# Altium schematic sheet 1_P1.schdoc
size 307 x 218 mm; Symbol: Drawing-Symbol_A4; Device: Drawing-Symbol_A4; @Project Name: orpheus552; @Page Count: 1; @Update Date: 2025-07-31; @Create Date: 2025-08-01; @Schematic Name: Schematic1; @Page No: 1; @Page Name: P1; Company: EasyEDA.com; Version: V1.0; Page Size: A4; @Create Time: 01:28:48; @Update Time: 18:28:48; Width: 1170; Height: 825; Region Start: 1; X Region Count: 6; Y Region Count: 4; Blade Width: 10; Title Block Position: 3; @Board Name: Board1
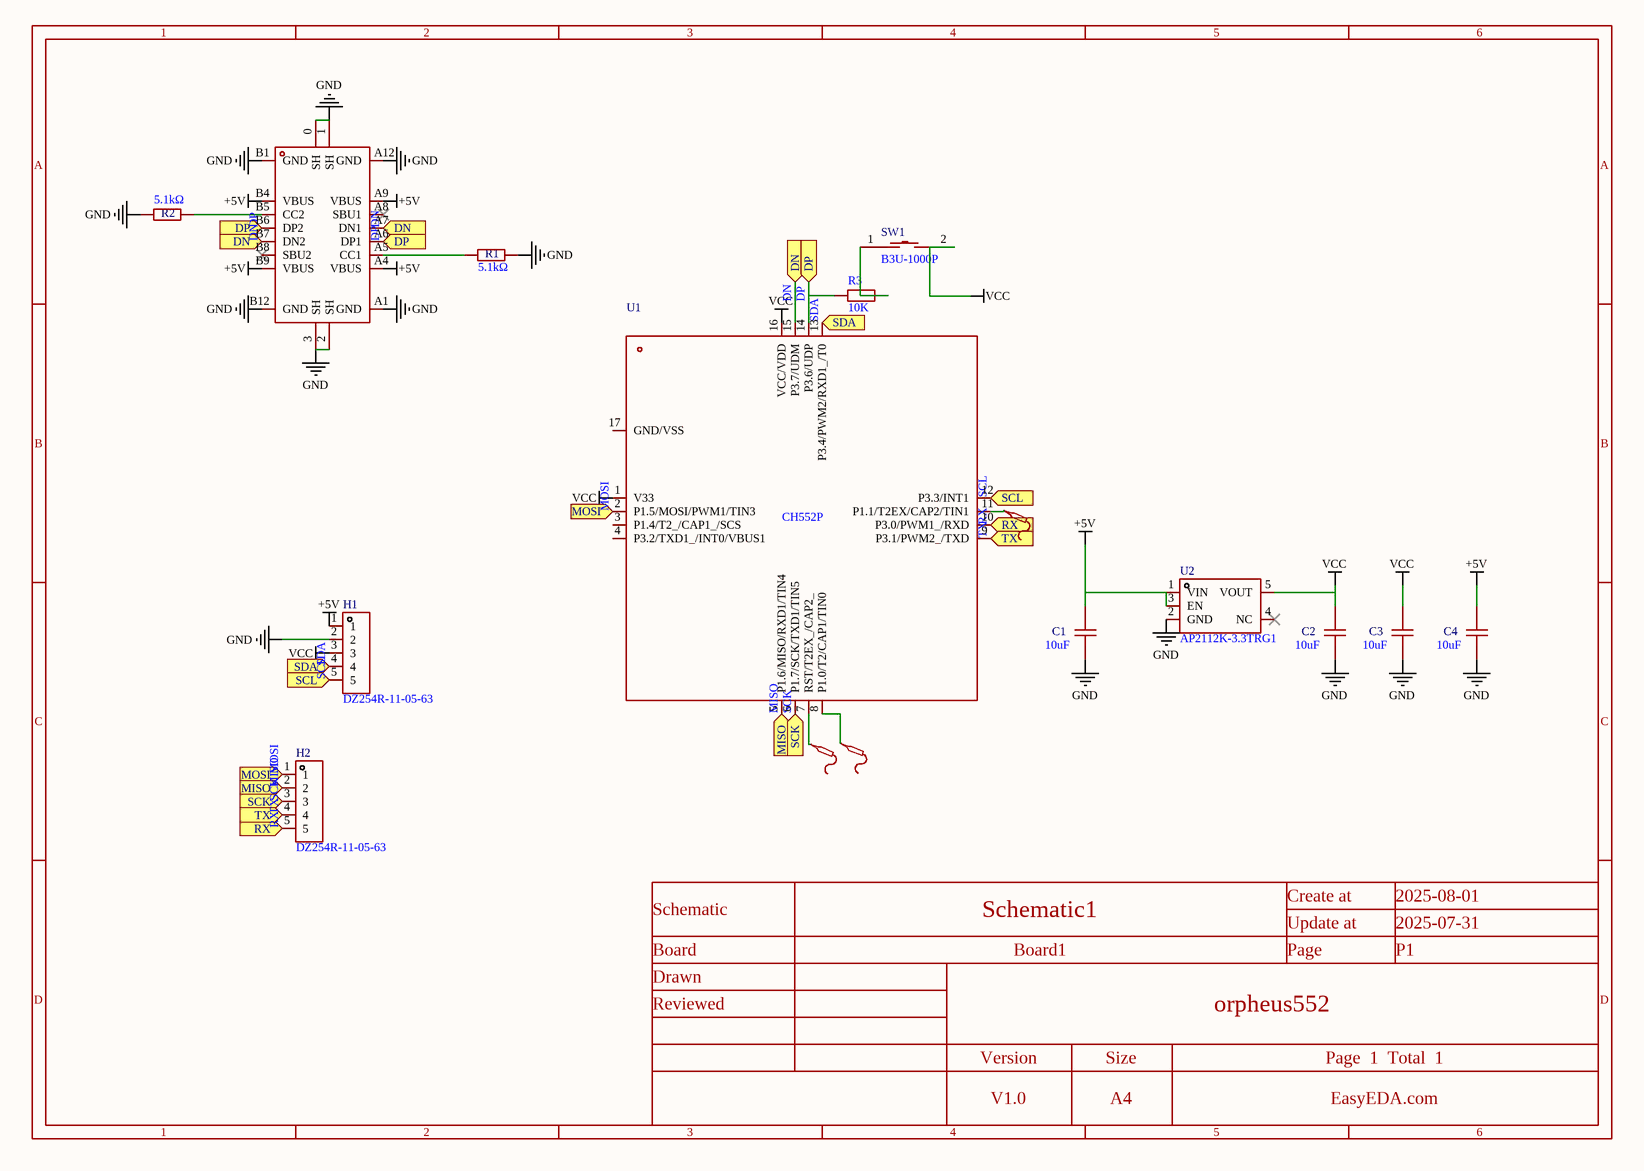
[diagram p0: 1_P1.schdoc]

## Parts
C1  10uF  [C0603]
C2  10uF  [C0603]
C3  10uF  [C0603]
C4  10uF  [C0603]
H1  DZ254R-11-05-63  [HDR-TH_5P-P2.54-V-M]
H2  DZ254R-11-05-63  [HDR-TH_5P-P2.54-V-M]
R1  5.1kΩ  [R0402]
R2  5.1kΩ  [R0402]
R3  10K  [R0603]
SW1  B3U-1000P  [KEY-SMD_B3U-1000PM]
TP3  (no value)  [Test-Point-0.5mm]
TP4  (no value)  [Test-Point-0.5mm]
TP5  (no value)  [Test-Point-0.5mm]
U1  CH552P  [VQFN-16_L3.0-W3.0-P0.50-BL-EP1.7]
U2  AP2112K-3.3TRG1  [SOT-23-5_L2.9-W1.6-P0.95-LS2.8-BR]
USBC2  TYPE-C-31-M-12  [USB-C_SMD-TYPE-C-31-M-12]  (value not drawn)

## Ports
DN (in), DP (in), MISO (in), MOSI (in), RX (in), SCK (in), SCL (in), SDA (in), TX (in)

## Nets
+5V: C1.2 C4.2 H1.1 U2.1(VIN) U2.3(EN) USBC2.A4(VBUS) USBC2.A9(VBUS) USBC2.B4(VBUS) USBC2.B9(VBUS)
GND: C1.1 C2.1 C3.1 C4.1 H1.2 R1.2 R2.1 U2.2(GND) USBC2.0(SH) USBC2.1(SH) USBC2.2(SH) USBC2.3(SH) USBC2.A1(GND) USBC2.A12(GND) USBC2.B1(GND) USBC2.B12(GND)
VCC: C2.2 C3.2 H1.3 SW1.2 U1.1(V33) U1.16(VCC/VDD) U2.5(VOUT)
DN: U1.15(P3.7/UDM) USBC2.A7(DN1) USBC2.B7(DN2) ; port DN
DP: R3.1 U1.14(P3.6/UDP) USBC2.A6(DP1) USBC2.B6(DP2) ; port DP
MISO: H2.2 U1.5(P1.6/MISO/RXD1/TIN4) ; port MISO
MOSI: H2.1 U1.2(P1.5/MOSI/PWM1/TIN3) ; port MOSI
RX: H2.5 U1.10(P3.0/PWM1_/RXD) ; port RX
SCK: H2.3 U1.6(P1.7/SCK/TXD1/TIN5) ; port SCK
SCL: H1.5 U1.12(P3.3/INT1) ; port SCL
SDA: H1.4 U1.13(P3.4/PWM2/RXD1_/T0) ; port SDA
TX: H2.4 U1.9(P3.1/PWM2_/TXD) ; port TX
NetR1_1: R1.1 USBC2.A5(CC1)
NetR2_2: R2.2 USBC2.B5(CC2)
NetR3_2: R3.2 SW1.1
NetTP3_1: TP3.1 U1.7(RST/T2EX_/CAP2_)
NetTP4_1: TP4.1 U1.8(P1.0/T2/CAP1/TIN0)
NetTP5_1: TP5.1 U1.11(P1.1/T2EX/CAP2/TIN1)

Not connected (* = marked no-connect by the designer): U1 3(P1.4/T2_/CAP1_/SCS) 4(P3.2/TXD1_/INT0/VBUS1) 17(GND/VSS); U2 4(NC)*; USBC2 A8(SBU1)* B8(SBU2)*

## Notes on the sheet
- 1
- 2
- 3
- 4
- 5
- 6
- A
- B
- C
- Schematic
- Schematic1
- Create at
- Update at
- 2025-08-01
- 2025-07-31
- Board
- Drawn
- Board1
- Page
- P1
- D
- Reviewed
- Version
- Size
- orpheus552
- Page  1  Total  1
- V1.0
- A4
- EasyEDA.com

## Library data of the parts
C1-C4 = CL10A106KP8NNNC: Manufacturer: SAMSUNG(三星); Add into BOM: yes; Tolerance: ±10%; Symbol: CL10A106KP8NNNC; Device: CL10A106KP8NNNC; LCSC Part Name: 10uF ±10% 10V; Supplier Part: C19702; Manufacturer Part: CL10A106KP8NNNC; Supplier Footprint: 0603; JLCPCB Part Class: Basic Part; Datasheet: https://atta.szlcsc.com/upload/public/pdf/source/20160218/1457707763339.pdf; Supplier: LCSC; Convert to PCB: yes; Value: 10uF
H1 H2 = DZ254R-11-05-63: Manufacturer: DEALON(德艺隆); Add into BOM: yes; Pin Structure: 1x5P; Pitch: 2.54mm; Circluar Pins/Square Pins: Pin Header; Current Rating: 3A; Symbol: DZ254R-11-05-63; Device: DZ254R-11-05-63; LCSC Part Name: 1x5P 间距:2.54mm 方针 直插; Supplier Part: C2935911; Manufacturer Part: DZ254R-11-05-63; Supplier Footprint: 插件,P=2.54mm; JLCPCB Part Class: Extended Part; Datasheet: https://atta.szlcsc.com/upload/public/pdf/source/20211231/575FA3133C71038A037ABECAE7869EE6.pdf; Supplier: LCSC; Convert to PCB: yes; Row Spacing: -; Mounting Type: Through Hole; Number of Rows: 1; Number of Pins: 5P; Voltage Rating (Max): -; Length of Mating Pin: 6mm; Insulation Height: 2.54mm; Length of End Connection Pin: 3mm; Operating Temperature: -; Color: -
R1 R2 = RMC04025.1K5%N: Manufacturer: Tyohm(幸亚电阻); Add into BOM: yes; Tolerance: ±5%; Symbol: RMC04025.1K5%N; Device: RMC04025.1K5%N; LCSC Part Name: 5.1kΩ ±5% 62.5mW; Supplier Part: C325524; Manufacturer Part: RMC04025.1K5%N; Supplier Footprint: 0402; JLCPCB Part Class: Extended Part; Datasheet: https://atta.szlcsc.com/upload/public/pdf/source/20190115/C325956_D27151D492FFB3C9AB4A6F14FE01F30A.pdf; Supplier: LCSC; Convert to PCB: yes; Value: 5.1kΩ
R3 = Res_0603: Symbol: Res; Convert to PCB: yes; Device: Res_0603; Add into BOM: yes; Supplier Footprint: 0603; Value: 10K
SW1 = B3U-1000P_C231329: Manufacturer: OMRON(欧姆龙); Add into BOM: yes; Circuit: SPST; Actuator Style: Round Button; Operating Force: 153gf; Switch Length: 3mm; Switch Width: 2.5mm; Switch Height: 1.6mm; Contact Current: 50mA; Voltage Rating (DC): 12V; Pin Style: SMDSplicing; Symbol: B3U-1000P; Device: B3U-1000P_C231329; LCSC Part Name: 3*2.5*1.6mm 立贴 轻触开关; Supplier Part: C231329; Manufacturer Part: B3U-1000P; Supplier Footprint: SMD,2.5x3mm; JLCPCB Part Class: Extended Part; Supplier: LCSC; Convert to PCB: yes; Mounting Style: Standing paste; With Lamp: -; Mechanical Life: -; Operating Temperature: -25℃~+70℃
TP3-TP5 = Test-Point: Add into BOM: yes; Symbol: Test-Point; Device: Test-Point; Convert to PCB: yes
U1 = CH552P: Manufacturer: WCH(南京沁恒); Add into BOM: yes; Symbol: CH552P; Device: CH552P; LCSC Part Name: CH552P; Supplier Part: C968536; Manufacturer Part: CH552P; Supplier Footprint: QFN-16; JLCPCB Part Class: Extended Part; Datasheet: https://atta.szlcsc.com/upload/public/pdf/source/20200819/C111292_2988E0DDEDF937C7B5A075A68BF2AC9C.pdf; Supplier: LCSC; Convert to PCB: yes
U2 = AP2112K-3.3TRG1_C23380830: Manufacturer: TECH PUBLIC(台舟); Add into BOM: yes; Output Type: Fixed; Voltage - Supply: 5.5V; Output Voltage: 3.3V; Output Current: 600mA; Power Supply Rejection Ratio (PSRR): 75dB@(1kHz); Voltage Dropout: 320mV@(600mA); standby current: 10uA; Output Configuration: Positive; Symbol: AP2112K-3.3TRG1_C23380830; Device: AP2112K-3.3TRG1_C23380830; LCSC Part Name: 集成电路; Supplier Part: C23380830; Manufacturer Part: AP2112K-3.3TRG1; Supplier Footprint: SOT-23-5; JLCPCB Part Class: Extended Part; Datasheet: https://atta.szlcsc.com/upload/public/pdf/source/20240628/1D097D6CC1633358334BACAAC860428E.pdf; Supplier: LCSC; Convert to PCB: yes; Features: Over Temperature Protection; Operating Temperature: -40℃~+85℃@(Ta)
USBC2 = TYPE-C-31-M-12: Manufacturer: 韩国韩荣; Add into BOM: yes; Connector Type: Type-C; Gender: Female; Number of Contacts: 16P; Number of Ports: 1; Current Rating - Power (Max): 5A; Symbol: TYPE-C-31-M-12; Device: TYPE-C-31-M-12; LCSC Part Name: Type-C 母; Supplier Part: C165948; Manufacturer Part: TYPE-C-31-M-12; Supplier Footprint: SMD; JLCPCB Part Class: Extended Part; Datasheet: https://atta.szlcsc.com/upload/public/pdf/source/20220525/466408E853115E789EDB0DDC29077C05.pdf; Supplier: LCSC; Convert to PCB: yes; Standard: -; Mounting Style: -; Operating Temperature Range: -